# EAGLE design Controllerv2 (EAGLE 9.1.3)

## Sheet 1 of 2
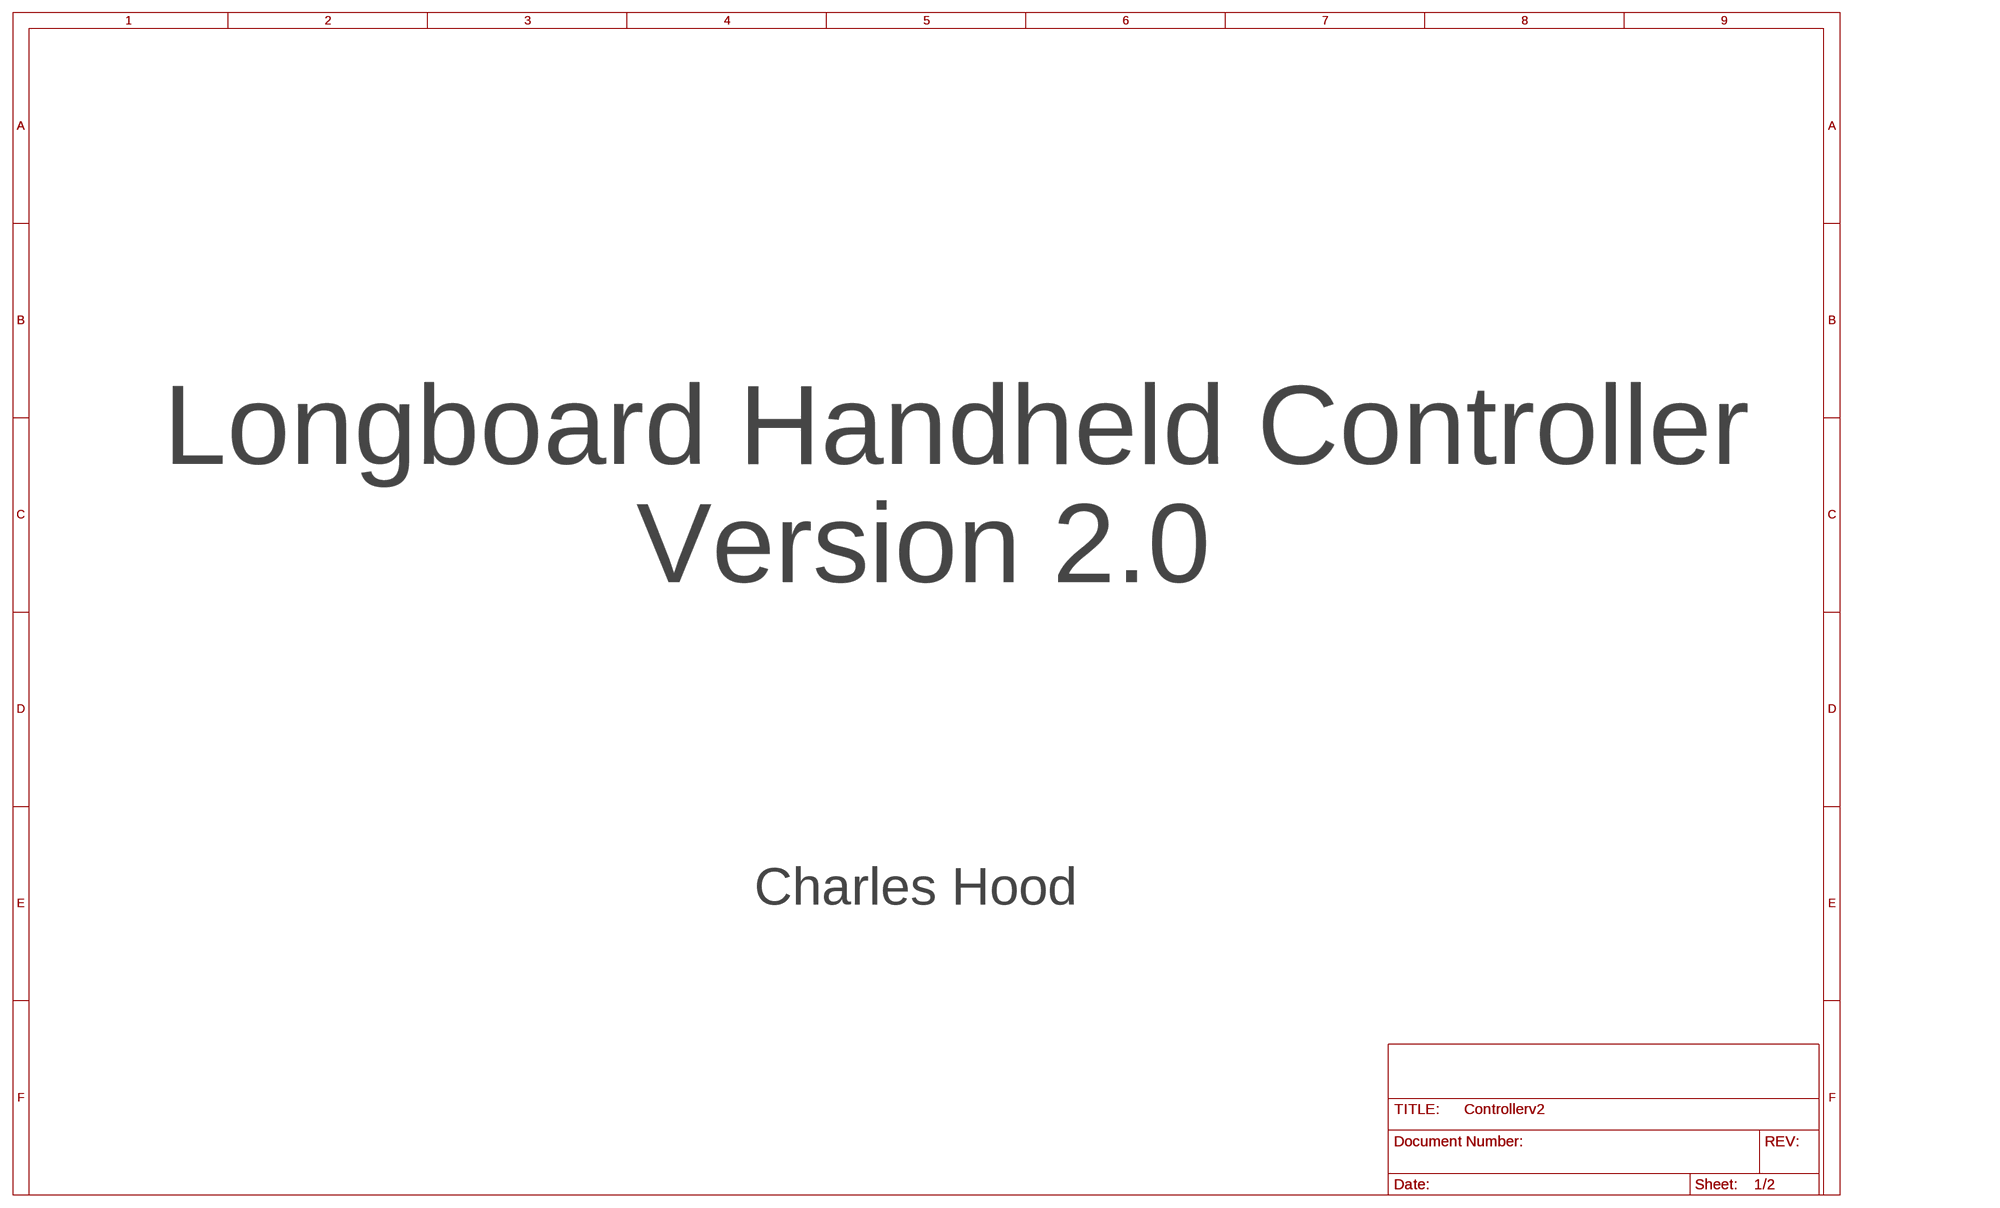
[diagram p0: schematic, sheet 1]

### Notes on the sheet
- Longboard Handheld Controller
- Version 2.0
- Charles Hood

## Sheet 2 of 2
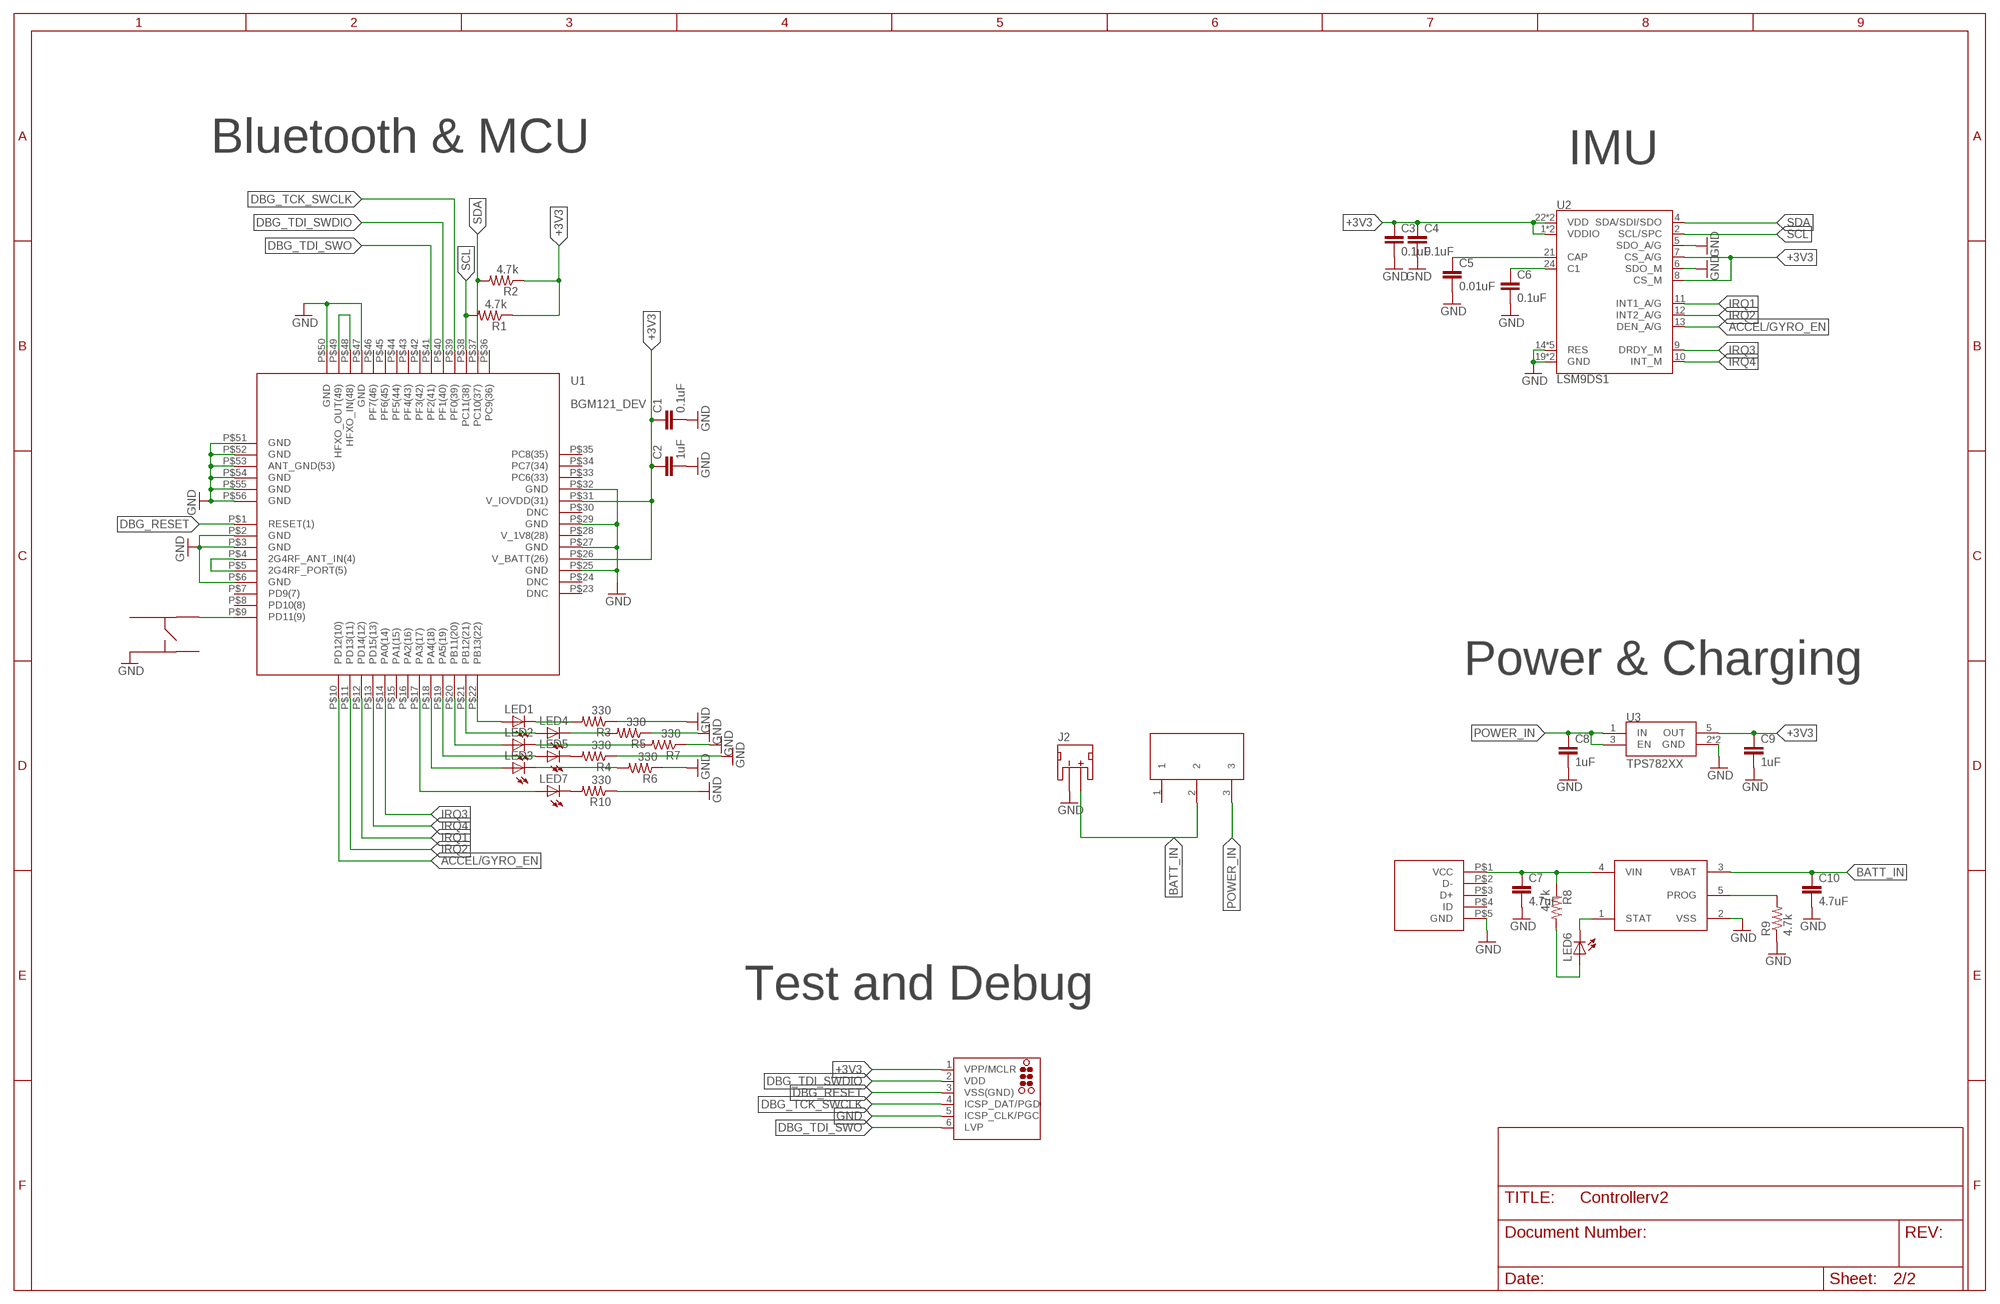
[diagram p1: schematic, sheet 2]

### Parts
C1  0.1uF  C-EUC0201  [C0201]
C2  1uF  C-EUC0201  [C0201]
C3  0.1uF  C-EUC0201  [C0201]
C4  0.1uF  C-EUC0201  [C0201]
C5  0.01uF  C-EUC0201  [C0201]
C6  0.1uF  C-EUC0201  [C0201]
C7  4.7uF  C-EUC0402  [C0402]
C8  1uF  C-EUC0201  [C0201]
C9  1uF  C-EUC0201  [C0201]
C10  4.7uF  C-EUC0402  [C0402]
J1  MICRO_USB  [MOLEX_USB]
J2  JST_2MM_MALE  [JST-2-SMD]
J3  TC2030-MCP-NL  [TC2030-MCP-NL]
LED1  LEDCHIP-LED0603  [CHIP-LED0603]
LED2  LEDCHIP-LED0603  [CHIP-LED0603]
LED3  LEDCHIP-LED0603  [CHIP-LED0603]
LED4  LEDCHIP-LED0603  [CHIP-LED0603]
LED5  LEDCHIP-LED0603  [CHIP-LED0603]
LED6  LEDCHIP-LED0603  [CHIP-LED0603]
LED7  LEDCHIP-LED0603  [CHIP-LED0603]
R1  4.7k  R-US_R0201  [R0201]
R2  4.7k  R-US_R0201  [R0201]
R3  330  R-US_R0201  [R0201]
R4  330  R-US_R0201  [R0201]
R5  330  R-US_R0201  [R0201]
R6  330  R-US_R0201  [R0201]
R7  330  R-US_R0201  [R0201]
R8  4.7k  R-US_R0201  [R0201]
R9  4.7k  R-US_R0201  [R0201]
R10  330  R-US_R0201  [R0201]
S1  KMR731NG  [KMR731NG]
U1  BGM121_DEV  [BGM121_PAC]
U2  LSM9DS1  [LGA24-8X4]
U3  TPS782XX  [SOT23-5L]
U4  MCP73831  [SOT23-5L]
U$1  SPDT_THRU  [SPDT_THRU]

### Nets
+3V3: C1.1 C2.1 C3.1 C4.1 C9.1 J3.1(VPP/MCLR) R1.1 R2.1 U1.P$26(V_BATT(26)) U1.P$31(V_IOVDD(31)) U2.1(VDDIO) U2.3(VDDIO) U2.7(CS_A/G) U2.8(CS_M) U2.22(VDD) U2.23(VDD) U3.5(OUT)
ACCEL/GYRO_EN: U1.P$10(PD12(10)) U2.13(DEN_A/G)
BATT_IN: C10.1 J2.2(+) U4.3(VBAT) U$1.2
DBG_RESET: J3.3(VSS(GND)) U1.P$1(RESET(1))
DBG_TCK_SWCLK: J3.4(ICSP_DAT/PGD) U1.P$39(PF0(39))
DBG_TDI_SWDIO: J3.2(VDD) U1.P$40(PF1(40))
DBG_TDI_SWO: J3.6(LVP) U1.P$41(PF2(41))
GND: C1.2 C2.2 C3.2 C4.2 C5.2 C6.2 C7.2 C8.2 C9.2 C10.2 J1.P$5(GND) J2.1(-) J3.5(ICSP_CLK/PGC) R3.1 R4.1 R5.1 R6.1 R7.1 R9.1 R10.1 S1.P$4 U1.P$2(GND) U1.P$3(GND) U1.P$6(GND) U1.P$25(GND) U1.P$27(GND) U1.P$29(GND) U1.P$32(GND) U1.P$47(GND) U1.P$50(GND) U1.P$51(GND) U1.P$52(GND) U1.P$53(ANT_GND(53)) U1.P$54(GND) U1.P$55(GND) U1.P$56(GND) U2.5(SDO_A/G) U2.6(SDO_M) U2.14(RES) U2.15(RES) U2.16(RES) U2.17(RES) U2.18(RES) U2.19(GND) U2.20(GND) U3.2(GND) U3.4(GND) U4.2(VSS)
IRQ1: U1.P$12(PD14(12)) U2.11(INT1_A/G)
IRQ2: U1.P$11(PD13(11)) U2.12(INT2_A/G)
IRQ3: U1.P$14(PA0(14)) U2.9(DRDY_M)
IRQ4: U1.P$13(PD15(13)) U2.10(INT_M)
N$1: LED1.A U1.P$22(PB13(22))
N$2: LED4.A U1.P$21(PB12(21))
N$3: LED2.A U1.P$20(PB11(20))
N$4: LED5.A U1.P$19(PA5(19))
N$5: LED3.C R6.2
N$6: LED3.A U1.P$18(PA4(18))
N$7: C5.1 U2.21(CAP)
N$8: C6.1 U2.24(C1)
N$9: C7.1 J1.P$1(VCC) R8.1 U4.4(VIN)
N$10: R9.2 U4.5(PROG)
N$11: LED6.A R8.2
N$12: LED6.C U4.1(STAT)
N$13: S1.P$2 U1.P$9(PD11(9))
N$14: LED7.C R10.2
N$15: LED7.A U1.P$17(PA3(17))
N$36: LED4.C R5.2
N$42: LED2.C R7.2
N$74: LED5.C R4.2
N$110: U1.P$4(2G4RF_ANT_IN(4)) U1.P$5(2G4RF_PORT(5))
N$112: LED1.C R3.2
N$113: U1.P$48(HFXO_IN(48)) U1.P$49(HFXO_OUT(49))
POWER_IN: C8.1 U3.1(IN) U3.3(EN) U$1.3
SCL: R1.2 U1.P$38(PC11(38)) U2.2(SCL/SPC)
SDA: R2.2 U1.P$37(PC10(37)) U2.4(SDA/SDI/SDO)
Unconnected: J1.P$2(D-) J1.P$3(D+) J1.P$4(ID) J2.NC1(PAD1) J2.NC2(PAD2) S1.P$1 S1.P$3 U1.P$7(PD9(7)) U1.P$8(PD10(8)) U1.P$15(PA1(15)) U1.P$16(PA2(16)) U1.P$23(DNC) U1.P$24(DNC) U1.P$30(DNC) U1.P$33(PC6(33)) U1.P$34(PC7(34)) U1.P$35(PC8(35)) U1.P$36(PC9(36)) U1.P$42(PF3(42)) U1.P$43(PF4(43)) U1.P$44(PF5(44)) U1.P$45(PF6(45)) U1.P$46(PF7(46)) U$1.1

### Notes on the sheet
- Bluetooth & MCU | IMU
- Power & Charging
- Test and Debug

## Power pins joined to a net without a drawn wire
V_1V8(28): U1.P$28(V_1V8(28))

## Library data of the parts
C1-C10 = rcl:C-EU: CAPACITOR, European symbol; SPICEPREFIX: C
J1 = James_Updated:MICRO_USB: Molex Micro USB AB RA SMD Bottom Mount
J2 = SparkFun-Connectors:JST_2MM_MALE: JST 2MM MALE RA CONNECTOR Two pin, compact surface mount connector. Commonly used as a battery input connection point. We really like the solid locking feeling and high current rating on these small connectors. We use these all the time as battery connectors. Mates to single-cell LiPo batteries. Here is the connector we sell at SparkFun: JST Right Angle Connector - White <https://www.sparkfun.com/products/8612> (PRT-08612) Datasheet <http://www.sparkfun.com/datasheets/Prototyping/Connectors/JST-Horizontal.pdf> It was used on these SparkFun products: SparkFun MOSFET Power Controller <https://www.sparkfun.com/products/11214> (PRT-11214) SparkFun Battery Babysitter - LiPo Battery Manager <https://www.sparkfun.com/products/13777> (PRT-13777) And many, many others that required a lipo battery connection.; PROD_ID: CONN-11443; SF_ID: PRT-08612
J3 = Tag-Connect-Footprints:TC2030: TAG-CONNECT ICSP Connector Manufacturer: Tag-Connect <http://www.tag-connect.com> Cable for easy In-Circuit Serial Programming. Designed for Microchip ICD2, suitable for many others. Two variants - one "with legs" (for hands-free fit on PCB) and another "without legs" for quick programming. PAD Description 1 MCLR/Vpp 2 Vdd 3 GND 4 PGD (ISPDAT) 5 PGC (ISPCLK) 6 nc (used for LVP) ©2009 ROFA.cz - modified and updated by Robert Darlington ‹rdarlington@gmail.com›
LED1-LED7 = adafruit:LED: LED OSRAM: - CHIPLED LG R971, LG N971, LY N971, LG Q971, LY Q971, LO R971, LY R971 LH N974, LH R974 LS Q976, LO Q976, LY Q976 LO Q996 - Hyper CHIPLED LW Q18S LB Q993, LB Q99A, LB R99A - SideLED LS A670, LO A670, LY A670, LG A670, LP A670 LB A673, LV A673, LT A673, LW A673 LH A674 LY A675 LS A676, LA A676, LO A676, LY A676, LW A676 LS A679, LY A679, LG A679 - Hyper Micro SIDELED® LS Y876, LA Y876, LO Y876, LY Y876 LT Y87S - SmartLED LW L88C, LW L88S LB L89C, LB L89S, LG L890 LS L89K, LO L89K, LY L89K LS L896, LA L896, LO L896, LY L896 - TOPLED LS T670, LO T670, LY T670, LG T670, LP T670 LSG T670, LSP T670, LSY T670, LOP T670, LYG T670 LG T671, LOG T671, LSG T671 LB T673, LV T673, LT T673, LW T673 LH T674 LS T676, LA T676, LO T676, LY T676, LB T676, LH T676, LSB T676, LW T676 LB T67C, LV T67C, LT T67C, LS T67K, LO T67K, LY T67K, LW E67C LS E67B, LA E67B, LO E67B, LY E67B, LB E67C, LV E67C, LT E67C LW T67C LS T679, LY T679, LG T679 LS T770, LO T770, LY T770, LG T770, LP T770 LB T773, LV T773, LT T773, LW T773 LH T774 LS E675, LA E675, LY E675, LS T675 LS T776, LA T776, LO T776, LY T776, LB T776 LHGB T686 LT T68C, LB T68C - Hyper Mini TOPLED® LB M676 - Mini TOPLED Santana® LG M470 LS M47K, LO M47K, LY M47K Source: http://www.osram.convergy.de/
R1-R10 = rcl:R-US_: RESISTOR, American symbol; SPICEPREFIX: R
S1 = Charles:KMR731NG: Tactile Switch SPST-NO Top Actuated Surface Mount
U1 = BGM121:BGM121_DEV: BGM121 - Blue Gecko BGM111 Bluetooth Smart® SiP Module Technical Specifications: Bluetooth 4.2 compliant Configurable TX power up to +8 dBm Range up to 200 meters ARM® Cortex-M4 @ up to 38.4 MHz Arrow: BGM121A256V1 <https://www.arrow.com/en/products/search?q=bgm121> Digikey: 336-3811-1-ND <https://www.digikey.com/product-search/en/rf-if-and-rfid/rf-transceiver-modules/3539948?k=bgm121> Mouser: 634-BGM121A256V1 <http://www.mouser.com/Search/Refine.aspx?Keyword=bgm121>
U2 = Charles:LSM9DS1: LSM9DS1 3D accelerometer, gyroscope & magnetometer The LSM9DS1 is a system-in-package featuring a 3D digital linear acceleration sensor, a 3D digital angular rate sensor, and a 3D digital magnetic sensor. The LSM9DS1 has a linear acceleration full scale of ±2g/±4g/±8/±16 g, a magnetic field full scale of ±4/±8/±12/±16 gauss and an angular rate of ±245/±500/±2000 dps. The LSM9DS1 includes an I2 C serial bus interface supporting standard and fast mode (100 kHz and 400 kHz) and an SPI serial standard interface. Magnetic, accelerometer and gyroscope sensing can be enabled or set in power-down mode separately for smart power management. The LSM9DS1 is available in a plastic land grid array package (LGA) and it is guaranteed to operate over an extended temperature range from -40 °C to +85 °C.; PROD_ID: IC-12536
U3 = James_Updated:TPS782XX: TPS782 500-nA IQ,150-mA, Ultra-Low Quiescent Current Low-Dropout Linear Regulator
U4 = James_Updated:MCP73831
U$1 = James_Updated:SPDT_THRU

## Net classes
0 default: width 0.152 mm, drill 0.305 mm, clearance 0.152 mm

## Board
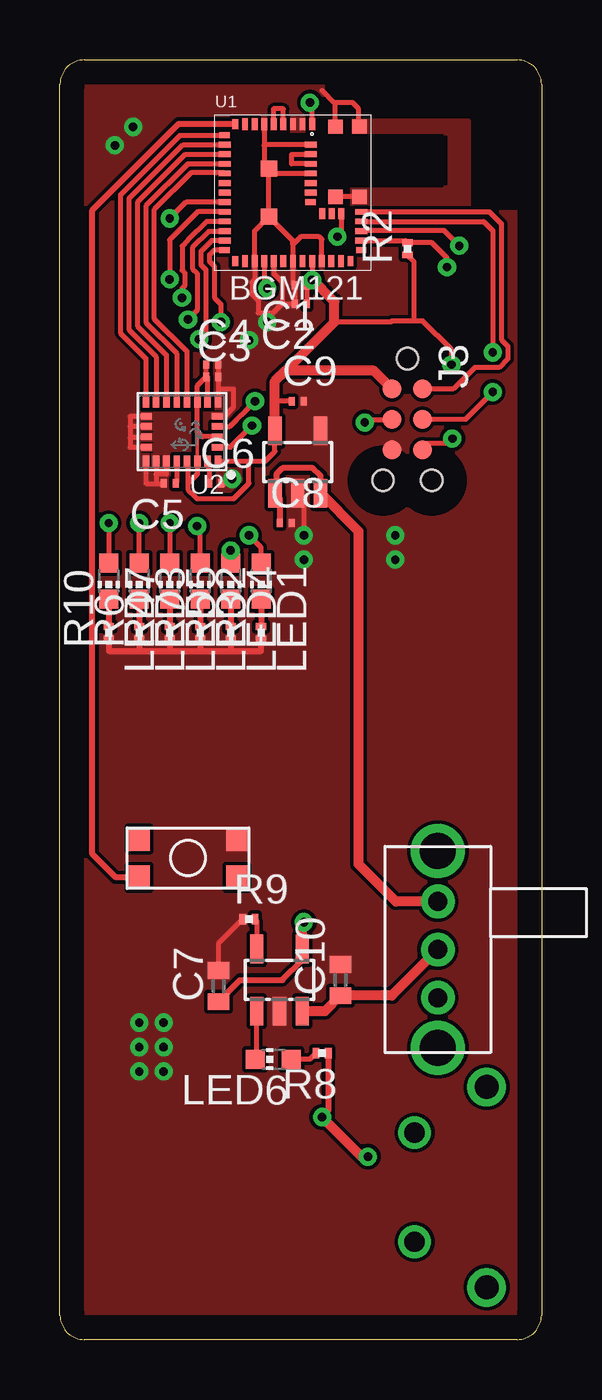
[diagram p2: board, top side]
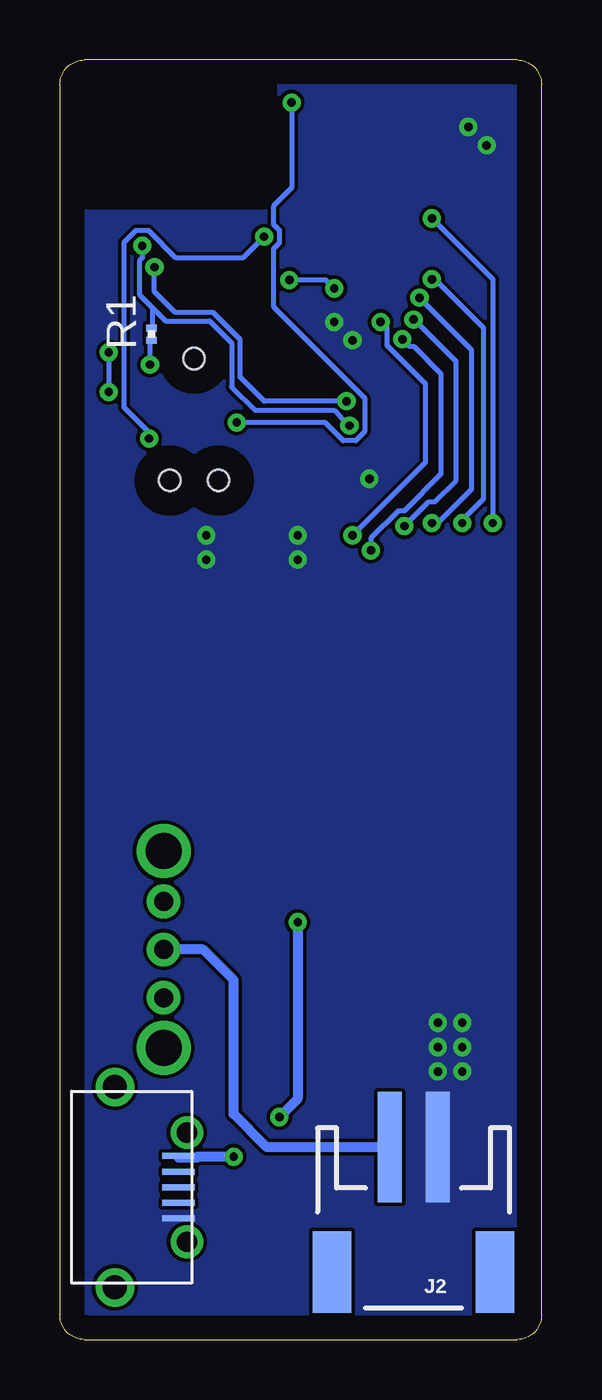
[diagram p3: board, bottom side, seen from below]

Size 20.07 x 53.34 mm. Coordinates in mm from the lower left corner, seen from the top.
Outline: 0,1.02 0,52.32 arc-90 1.02,53.34 19.05,53.34 arc-90 20.07,52.32 20.07,1.02 arc-90 19.05,0 1.02,0 arc-90 0,1.02
Copper layers (1*16): Top 0.035mm / dielectric 1.5mm / Bottom 0.035mm
Design rules "default": minimum track width 6mil, minimum drill 0.35mm, track to track 6mil, track to pad 6mil, pad to pad 6mil, via to via 6mil, smd to smd 6mil, copper to edge 40mil, drill to drill 6mil, minimum pad ring 10mil, minimum via ring 8mil, stop-mask expansion 4mil, vias tented up to drill 0mil, thermal gap 10mil
tRestrict: area 7.4,45.2 to 11.4,50.3

### Footprints (pad centres in the part's own frame; a part is rotated, then mirrored left to right if it is on the bottom)
C0201 = smd 0.25 x 0.35: 1 -0.25,0; 2 0.25,0
C0402 = smd 0.7 x 0.9: 1 -0.65,0; 2 0.65,0
MOLEX_USB = smd 0.25 x 1.35: P$1 -1.3,2.65; P$2 -0.65,2.65; P$3 0,2.65; P$4 0.65,2.65; P$5 1.3,2.65 | drill 0.85 pad 1.206: P$6 -2.276,3; P$7 2.276,3 | drill 1 pad 1.6: P$8 -4.175,0; P$9 4.175,0
JST-2-SMD = smd 1 x 4.6: 1 -1,-3.7; 2 1,-3.7 | smd 1.6 x 3.4: NC1 -3.4,1.5; NC2 3.4,1.5
TC2030-MCP-NL = smd 0.787 x 0.787: 1 1.27,-0.635; 2 1.27,0.635; 3 2.54,-0.635; 4 2.54,0.635; 5 3.81,-0.635; 6 3.81,0.635 | hole 0.889: 0,0; 5.08,-1.016; 5.08,1.016
CHIP-LED0603 = smd 0.8 x 0.8: A 0,-0.75; C 0,0.75
R0201 = smd 0.28 x 0.43: 1 -0.255,0; 2 0.255,0
KMR731NG = smd 0.9 x 1: P$1 -2.05,0.8; P$2 2.05,0.8; P$3 2.05,-0.8; P$4 -2.05,-0.8
BGM121_PAC = smd 0.245 x 0.5: P$1 3.65,5.7; P$2 3.25,5.7; P$3 2.85,5.7; P$4 2.45,5.7; P$5 2.05,5.7; P$6 1.65,5.7; P$7 1.25,5.7; P$8 0.85,5.7; P$24 0.85,0; P$25 1.25,0; P$26 1.65,0; P$27 2.05,0; P$28 2.45,0; P$29 2.85,0; P$30 3.25,0; P$31 3.65,0; P$32 4.05,0; P$33 4.45,0; P$34 4.85,0 | smd 0.245 x 0.425: P$9 0.45,5.7; P$23 0.45,0; P$35 5.25,0 | smd 0.425 x 0.245: P$10 0,5.25; P$22 0,0.45; P$36 5.7,0.45 | smd 0.5 x 0.245: P$11 0,4.85; P$12 0,4.45; P$13 0,4.05; P$14 0,3.65; P$15 0,3.25; P$16 0,2.85; P$17 0,2.45; P$18 0,2.05; P$19 0,1.65; P$20 0,1.25; P$21 0,0.85; P$37 5.7,0.85; P$38 5.7,1.25; P$39 5.7,1.65; P$40 5.7,2.05; P$45 3.585,2.85; P$46 3.585,3.25; P$47 3.585,3.65; P$48 3.585,4.05; P$49 3.585,4.45; P$50 3.585,4.85 | smd 0.245 x 0.45: P$41 4.865,1.98; P$42 4.465,1.98; P$43 4.065,1.98 | smd 0.45 x 0.245: P$44 3.585,2.45 | smd 0.67 x 0.67: P$51 1.85,3.85; P$52 1.85,1.85 | smd 0.6 x 0.6: P$53 5.615,5.6; P$54 4.615,5.6; P$55 4.615,2.68; P$56 5.615,2.68
LGA24-8X4 = smd 0.27 x 0.45: 1 -1.505,1.225; 6 -1.505,-1.225; 7 -1.075,-1.225; 8 -0.645,-1.225; 9 -0.215,-1.225; 10 0.215,-1.225; 11 0.645,-1.225; 12 1.075,-1.225; 13 1.505,-1.225; 18 1.505,1.225; 19 1.075,1.225; 20 0.645,1.225; 21 0.215,1.225; 22 -0.215,1.225; 23 -0.645,1.225; 24 -1.075,1.225 | smd 0.45 x 0.27: 2 -1.475,0.645; 3 -1.475,0.215; 4 -1.475,-0.215; 5 -1.475,-0.645; 14 1.475,-0.645; 15 1.475,-0.215; 16 1.475,0.215; 17 1.475,0.645
SOT23-5L = smd 0.55 x 1.2: 1 -0.95,-1.3; 2 0,-1.3; 3 0.95,-1.3; 4 0.95,1.3; 5 -0.95,1.3
SPDT_THRU = drill 0.787 pad 1.397: 1 -2.007,0; 2 0,0; 3 2.007,0 | drill 1.499: A1 -4.102,0; A2 4.102,0

### Placement (x,y rotation side)
C1  10.03,43.94 180 top
C2  10.03,43.18 180 top
C3  6.35,40.13 0 top
C4  6.35,40.64 0 top
C5  4.57,35.69 180 top
C6  6.48,35.69 0 top
C7  6.6,14.73 90 top
C8  9.4,34.04 0 top
C9  9.91,39.12 0 top
C10  11.68,14.99 90 top
J1  17.78,6.35 270 bottom
J2  5.33,4.32 180 bottom
J3  14.48,40.89 270 top
LED1  8.38,31.62 180 top
LED2  5.84,31.62 180 top
LED3  3.3,31.62 180 top
LED4  7.11,31.62 180 top
LED5  4.57,31.62 180 top
LED6  8.89,11.68 90 top
LED7  2.03,31.62 180 top
R1  16.26,41.91 90 bottom
R2  14.48,45.47 90 top
R3  8.38,29.46 90 top
R4  4.57,29.46 90 top
R5  7.11,29.46 90 top
R6  3.3,29.46 90 top
R7  5.84,29.46 90 top
R8  10.92,11.94 180 top
R9  7.87,17.53 0 top
R10  2.03,29.46 90 top
S1  5.33,20.07 180 top
U1  6.86,44.96 0 top
U2  5.08,37.85 180 top
U3  9.91,36.58 0 top
U4  9.14,14.99 0 top
U$1  15.75,16.26 90 top

### Tracks (layer width: path | path; a pad name or v marks a point on that pad's centre or on a via)
+3V3  (via drill 0.35)
  Top 0.152: U2.23 5.72,37.84 5.71,37.85
  Top 0.203: U2.7 6.16,40.13 C3.1 | C3.1 5.72,39.76 U2.8 5.72,37.86 5.71,37.85 5.93,37.63 U2.3 | C3.1 C4.1 | U2.22 5.33,36.58 5.33,35.69 | 5.33,35.69 5.33,35.43 5.71,35.05 7.24,35.05 7.87,35.69 7.87,36.62 | U2.23 5.72,36.08 5.33,35.69 | U2.1 7.87,36.62 | 7.87,36.62 8.55,36.62 8.96,37.02 U3.5 | U1.P$31 10.51,44.2 v10.51,44.17 C1.1 C2.1 | U1.P$26 8.51,43.94 v8.64,43.81 | v16.32,40.64 16.32,41.26 15.12,42.46 14.73,42.46 | 11.43,42.42 13.79,42.42 13.83,42.46 14.73,42.46 | C9.1 8.96,39.12 | R2.1 14.73,44.96 14.73,42.46
  Top 0.406: U3.5 8.96,39.12 8.96,39.94 9.4,40.39 | 9.4,40.39 11.43,42.42 11.43,43.27 10.51,44.2 | J3.1 13.08,40.39 9.4,40.39
  Bottom 0.203: v8.64,43.81 8.99,44.17 v10.51,44.17 | R1.1 16.32,41.59 v16.32,40.64
ACCEL/GYRO_EN
  Top 0.203: U1.P$10 6.83,50.18 4.99,50.18 2.52,47.71 2.52,41.96 3.58,40.9 U2.13
BATT_IN
  Top 0.406: U$1.2 13.83,14.34 C10.1 11.03,13.69 U4.3
  Bottom 0.406: J2.2 11.45,8.02 12.83,9.4 12.83,14.99 14.1,16.26 U$1.2
DBG_RESET  (via drill 0.35)
  Top 0.203: U1.P$1 10.51,51.47 v10.41,51.56 | v12.7,38.23 12.83,38.35 J3.3
  Bottom 0.203: v12.7,38.23 9.02,38.23 8.26,37.47 7.74,37.47 7.37,37.84 7.37,39.25 11.18,43.06 11.18,45.46 10.93,45.71 10.93,46.24 11.18,46.49 11.18,47.24 10.41,48.01 v10.41,51.56
DBG_TCK_SWCLK  (via drill 0.35)
  Top 0.203: U1.P$39 17.65,46.61 18.03,46.23 v18.03,41.15 | v18.03,39.5 16.89,38.35 J3.4
  Bottom 0.203: v18.03,41.15 v18.03,39.5
DBG_TDI_SWDIO
  Top 0.152: J3.2 15.27,39.47
  Top 0.203: 15.27,39.47 15.42,39.62 16.38,39.62 17.27,40.52 18.3,40.52 18.67,40.89 18.67,41.41 18.39,41.69 18.39,46.51 17.89,47.01 U1.P$40
DBG_TDI_SWO  (via drill 0.35)
  Top 0.152: J3.6 15.11,37.38
  Top 0.203: U1.P$41 11.72,46.14 v11.56,45.97 | v16.35,37.56 16.17,37.38 15.11,37.38
  Bottom 0.203: v11.56,45.97 12.45,45.09 15.23,45.09 16.38,46.23 16.9,46.23 17.4,45.73 17.4,38.86 16.35,37.81 v16.35,37.56
GND  (via drill 0.35)
  Top 0.203: C4.2 C3.2 6.6,39.62 | 6.6,39.62 6.6,39.09 U2.6 | U2.5 6.87,38.49 7.24,38.86 7.24,39.62 6.6,39.62 | U2.18 3.58,35.69 4,35.69 | 4,35.69 C5.2 | U2.19 4,36.07 | 4,36.07 4,35.69 | U2.20 4.43,36.07 4,36.07 | U2.14 2.92,38.48 2.92,38.06 | 2.92,38.06 2.92,37.59 | 2.92,37.59 2.92,37.2 U2.17 | U2.16 3.6,37.59 2.92,37.59 | U2.15 2.92,38.06 | C6.2 7.17,35.69 v7.17,35.88 | U1.P$27 8.91,44.44 9.27,44.08 9.27,43.18 | 9.27,43.18 C2.2 C1.2 9.71,44.02 U1.P$29 9.71,45.65 | 9.27,43.18 8.89,42.8 8.26,42.8 8.26,43.3 8,43.55 8,44.08 8.11,44.18 U1.P$25 8.11,46.21 U1.P$52 | U1.P$32 10.91,45.86 10.79,45.97 10.03,45.97 9.71,45.65 | R9.1 6.6,16.51 C7.2 | U1.P$56 U1.P$55 | 8.53,50.39 8.53,50.66 U1.P$6 8.51,49.78 | 8.51,49.78 8.51,48.81 U1.P$51 | U1.P$52 U1.P$51 | 9.71,45.65 9.71,45.81 U1.P$52 | U1.P$47 8.91,48.61 U1.P$51 | U1.P$50 8.53,49.81 8.51,49.78 | U1.P$54 11.47,51.52 11.43,51.56 | 11.43,51.56 10.92,52.07 | U1.P$53 12.45,50.59 12.45,51.31 12.19,51.56 11.43,51.56 | U3.2 10.16,35.02 v10.16,33.53
  Top 0.254: R10.1 2.03,28.7 3.3,28.7 | 3.3,28.7 4.57,28.7 | 4.57,28.7 5.84,28.7 | 5.84,28.7 7.11,28.7 | 7.11,28.7 8.38,28.7 R3.1 | R7.1 5.84,28.7 | R4.1 4.57,28.7 | R6.1 3.3,28.7 | R5.1 7.11,28.7
  Bottom 0.203: v7.17,35.88 7.17,35.81 7.24,35.81
  other vias: 10.16,32.51 13.97,33.53 13.97,32.51 8.64,42.42 7.87,41.66 3.05,50.55 2.29,49.78 4.32,11.18 4.32,12.19 4.32,13.21 3.3,13.21 3.3,12.19 3.3,11.18
  pour Top (no thermals): 12.19,50.29 12.19,50.8 17.02,50.8 17.02,47.24 12.19,47.24 12.19,48.01 16.26,48.01 16.26,50.29
  pour Top (no thermals): 10.92,54.61 10.92,46.99 20.83,46.99 20.83,-0.51 -1.02,-0.51 -1.02,54.61
  pour Bottom (no thermals): -1.27,54.86 10.92,54.86 10.92,46.99 21.08,46.99 21.08,-1.27 -1.27,-1.27
IRQ1
  Top 0.203: U1.P$12 6.83,49.38 5.2,49.38 3.23,47.41 3.23,42.25 4.43,41.04 U2.11
IRQ2
  Top 0.203: U1.P$11 6.83,49.78 5.1,49.78 2.87,47.56 2.87,42.1 4,40.97 U2.12
IRQ3
  Top 0.203: U2.9 5.29,41.19 3.94,42.55 3.94,47.12 5.46,48.64 6.49,48.64 6.5,48.63 6.83,48.63 U1.P$14
IRQ4
  Top 0.203: U2.10 4.87,41.11 3.58,42.4 3.58,47.26 5.31,49 6.85,49 U1.P$13
N$1  (via drill 0.35)
  Top 0.203: U1.P$22 6.42,45.41 6.22,45.21 6.22,44.95 6.43,44.74 6.43,43.43 6.71,43.16 v6.71,42.42 | LED1.A 8.38,33.02 v7.87,33.53
  Bottom 0.203: v7.87,33.53 4.83,36.58 4.83,39.83 6.43,41.44 6.43,42.14 v6.71,42.42
N$2  (via drill 0.35)
  Top 0.203: U1.P$21 6.32,45.81 5.87,45.36 5.87,44.96 5.87,44.8 6.07,44.59 6.07,41.97 v5.8,41.7 | v7.11,32.89 LED4.A
  Bottom 0.203: v5.8,41.7 5.5,41.4 5.33,41.4 4.19,40.26 4.19,36.07 5.72,34.54 5.98,34.54 7.11,33.41 v7.11,32.89
N$3  (via drill 0.35)
  Top 0.203: U1.P$20 6.83,46.18 6.19,46.18 5.51,45.51 5.51,45.09 5.51,44.65 5.72,44.44 5.72,42.9 v5.33,42.52 | LED2.A 5.84,33.78 v5.71,33.91
  Bottom 0.203: v5.71,33.91 4.7,34.92 4.45,34.92 3.56,35.81 3.56,40.77 5.31,42.52 v5.33,42.52
N$4  (via drill 0.35)
  Top 0.203: U1.P$19 6.11,46.61 5.33,45.83 5.09,45.58 5.09,44.57 5.2,44.46 5.2,43.93 5.09,43.82 v5.09,43.43 | v4.57,34.04 LED5.A
  Bottom 0.203: v5.09,43.43 2.92,41.26 2.92,35.43 4.32,34.04 v4.57,34.04
N$5
  Top 0.254: LED3.C R6.2
N$6  (via drill 0.35)
  Top 0.203: U1.P$18 5.73,47.01 5.2,46.48 5.2,46.47 4.83,46.1 4.57,45.84 v4.57,44.2 | LED3.A v3.3,34.04
  Bottom 0.203: v3.3,34.04 3.3,34.16 2.41,35.05 2.41,42.16 4.45,44.2 v4.57,44.2
N$7
  Top 0.203: U2.21 4.87,35.73 C5.1
N$8
  Top 0.203: U2.24 6.2,36.58 6.2,36.29 6.23,36.26 C6.1
N$9  (via drill 0.35)
  Top 0.254: R8.1 11.18,9.53 v10.92,9.27 | C7.1 7.51,14.99 9.27,14.99 10.09,15.81 U4.4
  Top 0.406: U4.4 10.09,17.33 v10.16,17.4 | v10.92,9.27 12.57,7.62 v12.83,7.62
  Bottom 0.152: J1.P$1 15.13,7.59
  Bottom 0.406: v10.16,17.4 10.16,10.03 v10.92,9.27 | v12.83,7.62 14.32,7.62 14.35,7.59 15.13,7.59
N$10
  Top 0.203: R9.2 8.19,17.46 U4.5
N$11
  Top 0.203: R8.2 10.41,11.68 LED6.A
N$12
  Top 0.203: LED6.C 8.19,11.74 U4.1
N$13
  Top 0.152: U1.P$9 7.29,50.67
  Top 0.254: S1.P$2 2.32,19.27 1.35,20.24 1.35,47.08 4.94,50.67 7.29,50.67 U1.P$9
N$14
  Top 0.254: LED7.C R10.2
N$15  (via drill 0.35)
  Top 0.203: U1.P$17 5.24,47.41 v4.57,46.74 | v2.03,34.04 LED7.A
  Bottom 0.203: v4.57,46.74 2.03,44.2 v2.03,34.04
N$36
  Top 0.254: LED4.C R5.2
N$42
  Top 0.254: LED2.C R7.2
N$74
  Top 0.254: LED5.C R4.2
N$110
  Top 0.203: U1.P$5 8.89,50.66 8.89,51.31 9.31,51.31 U1.P$4
N$112
  Top 0.254: LED1.C R3.2
N$113
  Top 0.203: U1.P$48 9.65,49.01 9.65,49.41 U1.P$49
POWER_IN
  Top 0.254: C8.1 9.15,35.08 U3.1 9.02,35.34 9.02,36.07 9.27,36.32 10.54,36.32 10.86,36.01 U3.3
  Top 0.406: U$1.3 13.99,18.26 12.45,19.81 12.45,33.69 U3.3
SCL  (via drill 0.35)
  Top 0.203: v16.64,45.59 16,46.23 12.56,46.23 U1.P$38 | v8,38.1 7.1,37.2 U2.2
  Bottom 0.203: v16.64,45.59 16.64,45.09 16.76,44.97 16.76,43.56 16.19,42.99 | 16.19,42.99 15.66,42.46 13.83,42.46 12.92,41.54 12.92,39.71 11.94,38.73 8.64,38.73 8.39,38.48 8.38,38.48 v8,38.1 | R1.2 16.19,42.16 16.19,42.99
SDA  (via drill 0.35)
  Top 0.203: U2.4 7.07,38.06 7.37,38.36 7.74,38.73 v8.13,39.12 | v16.13,44.7 16.13,45.09 15.49,45.72 R2.2 14.39,45.81 U1.P$37
  Bottom 0.203: v8.13,39.12 11.56,39.12 12.56,40.12 12.56,41.69 13.68,42.81 15.25,42.81 16.13,43.69 v16.13,44.7